# Altium schematic sheet 16encoder.SchDoc
size 381 x 558 mm; SheetNumber: 1; SheetTotal: 2
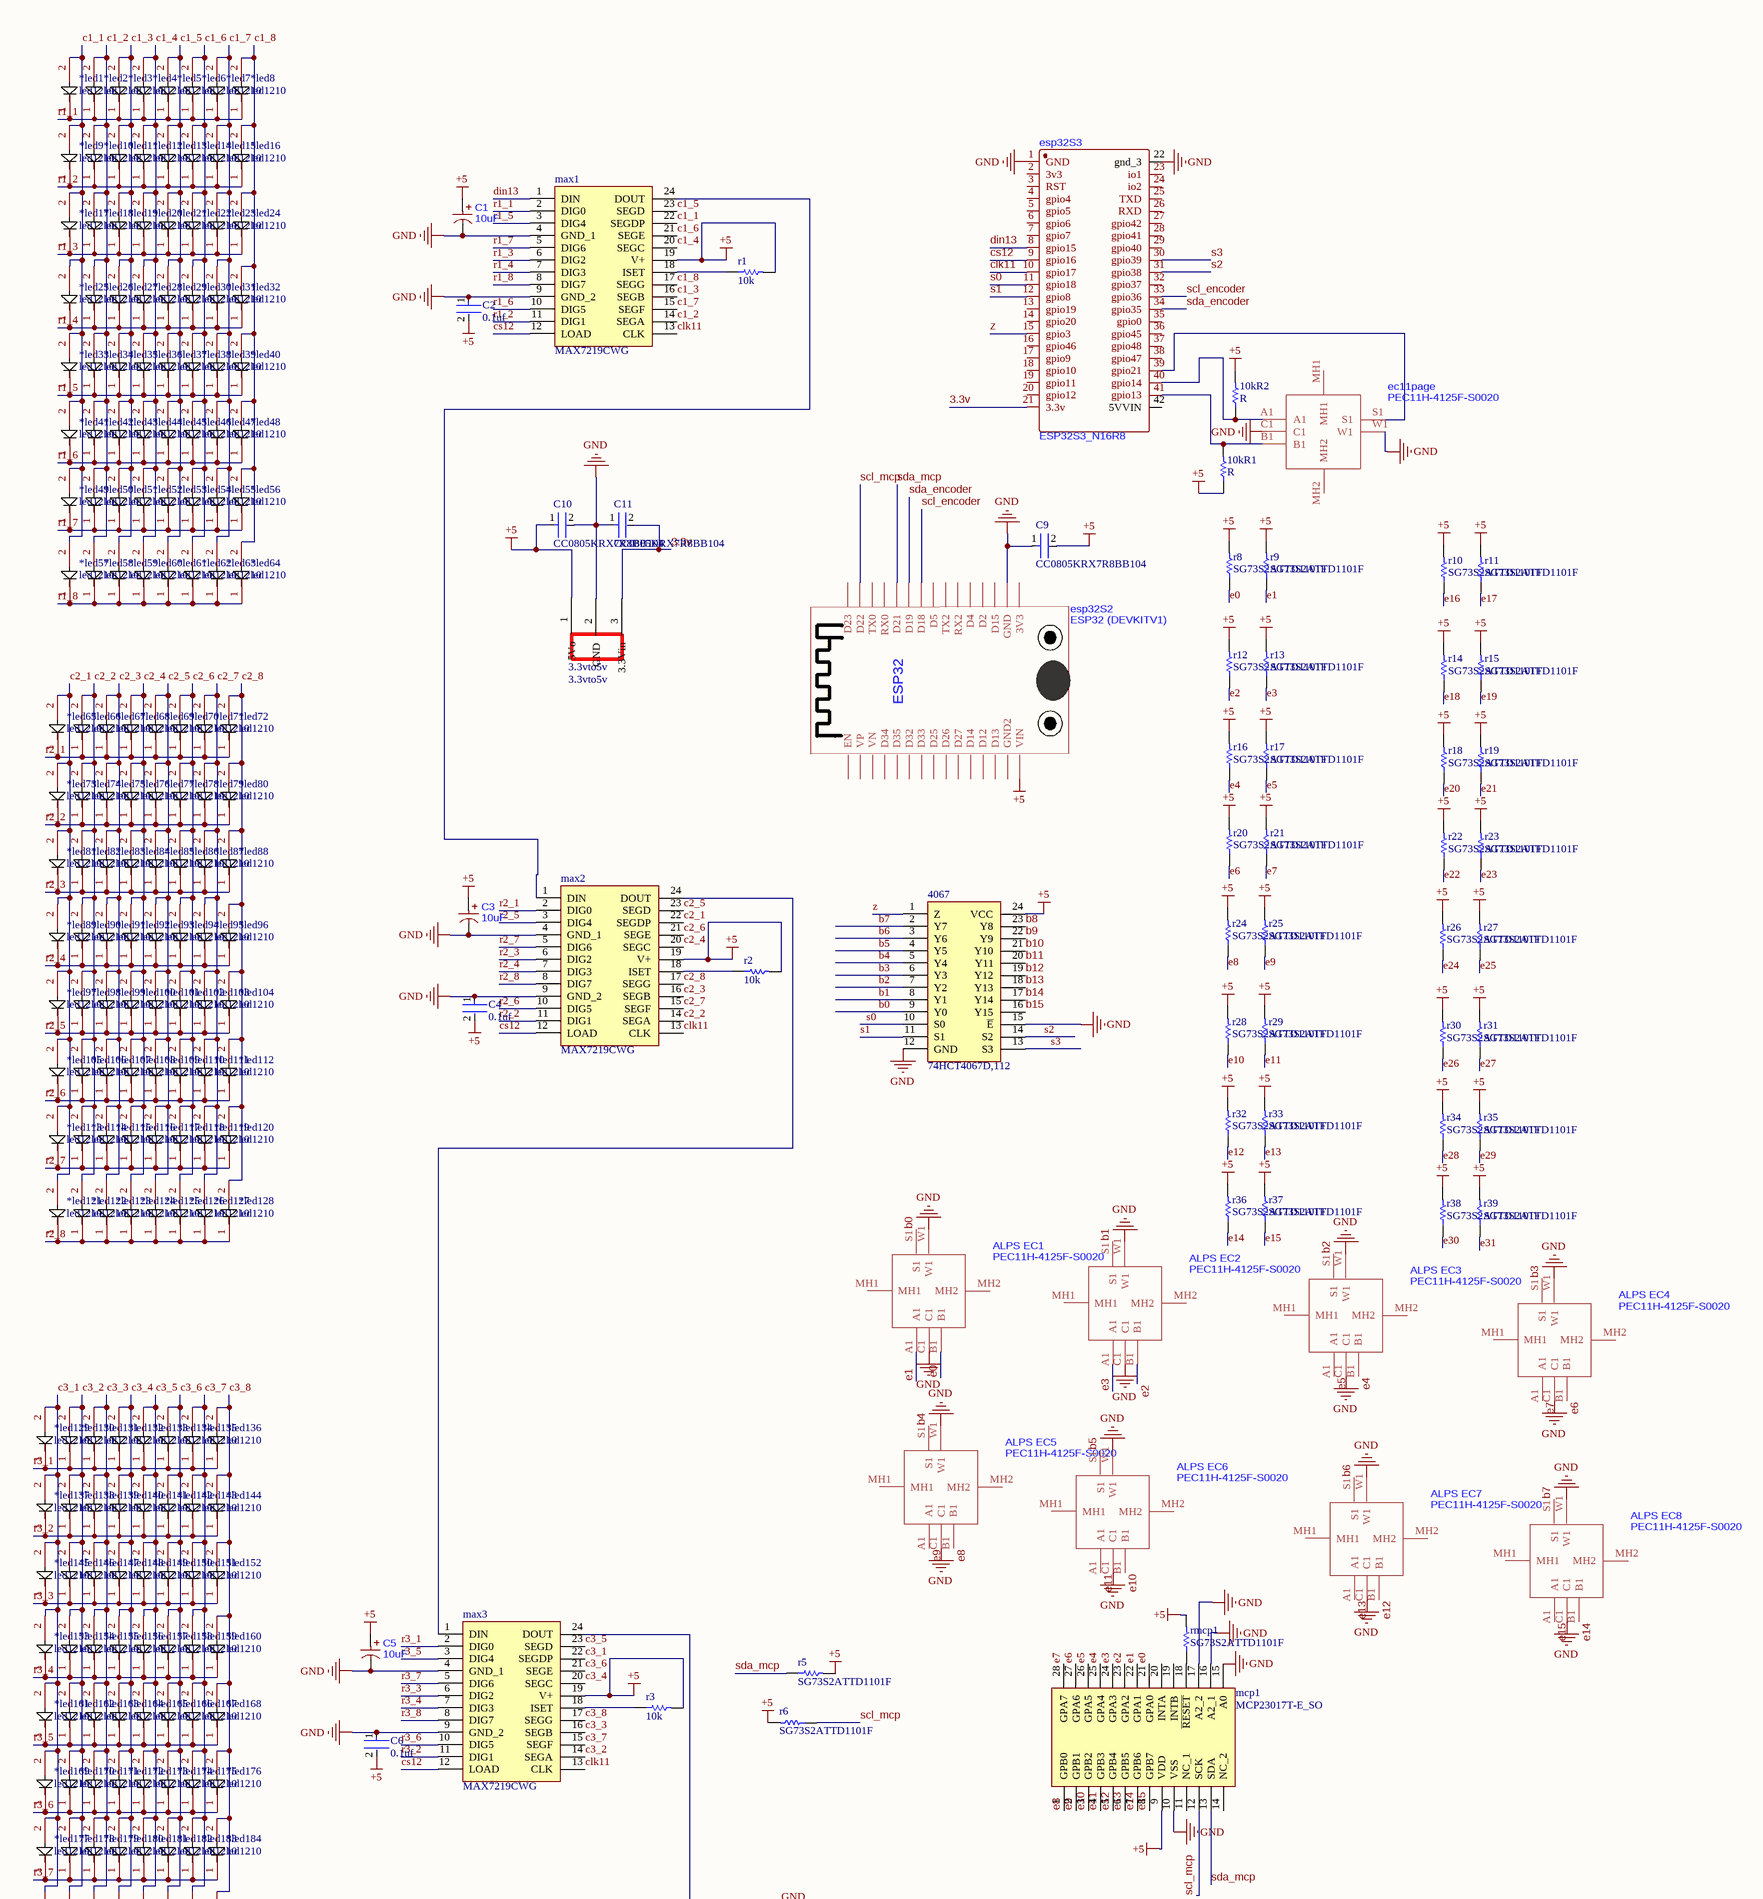
[diagram p0: 16encoder.SchDoc, top]
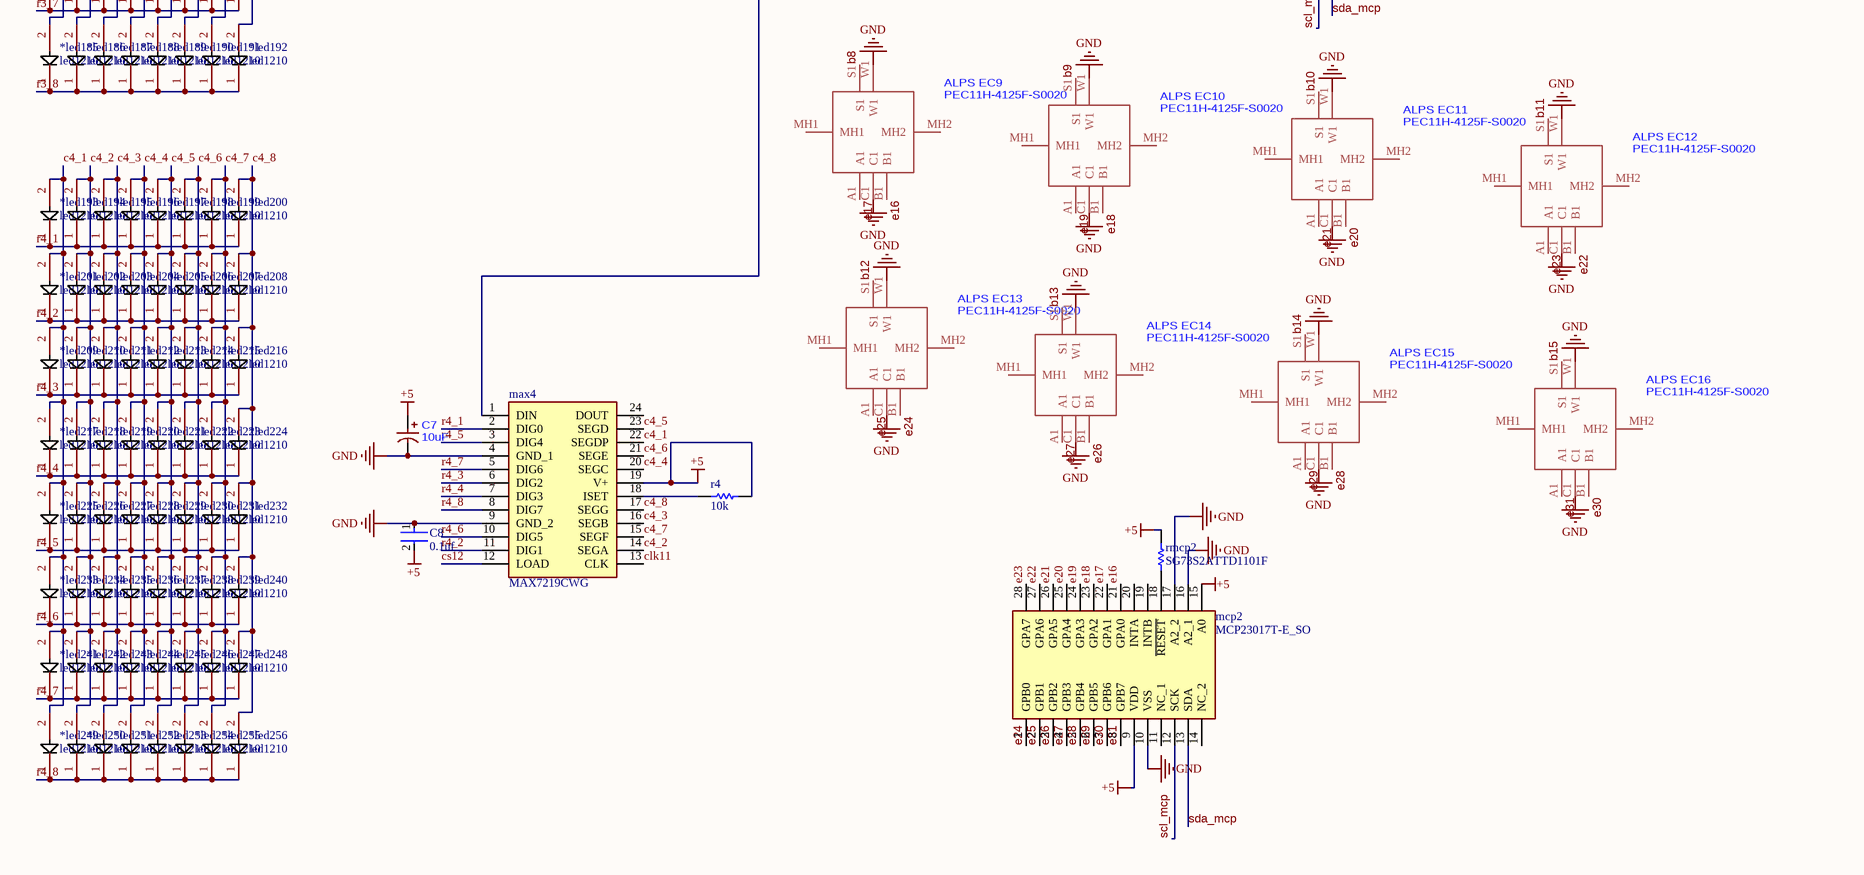
[diagram p1: 16encoder.SchDoc, bottom]

## Parts
3.3vto5v  3.3vto5v  [3.3vto5v]
10kR1  R  [RESC2013X60X30LL20T20]
10kR2  R  [RESC2013X60X30LL20T20]
4067  74HCT4067D,112  [SOIC127P1032X265-24N]
*led1  led1210  [1210贴片led]
*led2  led1210  [1210贴片led]
*led3  led1210  [1210贴片led]
*led4  led1210  [1210贴片led]
*led5  led1210  [1210贴片led]
*led6  led1210  [1210贴片led]
*led7  led1210  [1210贴片led]
*led8  led1210  [1210贴片led]
*led9  led1210  [1210贴片led]
*led10  led1210  [1210贴片led]
*led11  led1210  [1210贴片led]
*led12  led1210  [1210贴片led]
*led13  led1210  [1210贴片led]
*led14  led1210  [1210贴片led]
*led15  led1210  [1210贴片led]
*led16  led1210  [1210贴片led]
*led17  led1210  [1210贴片led]
*led18  led1210  [1210贴片led]
*led19  led1210  [1210贴片led]
*led20  led1210  [1210贴片led]
*led21  led1210  [1210贴片led]
*led22  led1210  [1210贴片led]
*led23  led1210  [1210贴片led]
*led24  led1210  [1210贴片led]
*led25  led1210  [1210贴片led]
*led26  led1210  [1210贴片led]
*led27  led1210  [1210贴片led]
*led28  led1210  [1210贴片led]
*led29  led1210  [1210贴片led]
*led30  led1210  [1210贴片led]
*led31  led1210  [1210贴片led]
*led32  led1210  [1210贴片led]
*led33  led1210  [1210贴片led]
*led34  led1210  [1210贴片led]
*led35  led1210  [1210贴片led]
*led36  led1210  [1210贴片led]
*led37  led1210  [1210贴片led]
*led38  led1210  [1210贴片led]
*led39  led1210  [1210贴片led]
*led40  led1210  [1210贴片led]
*led41  led1210  [1210贴片led]
*led42  led1210  [1210贴片led]
*led43  led1210  [1210贴片led]
*led44  led1210  [1210贴片led]
*led45  led1210  [1210贴片led]
*led46  led1210  [1210贴片led]
*led47  led1210  [1210贴片led]
*led48  led1210  [1210贴片led]
*led49  led1210  [1210贴片led]
*led50  led1210  [1210贴片led]
*led51  led1210  [1210贴片led]
*led52  led1210  [1210贴片led]
*led53  led1210  [1210贴片led]
*led54  led1210  [1210贴片led]
*led55  led1210  [1210贴片led]
*led56  led1210  [1210贴片led]
*led57  led1210  [1210贴片led]
*led58  led1210  [1210贴片led]
*led59  led1210  [1210贴片led]
*led60  led1210  [1210贴片led]
*led61  led1210  [1210贴片led]
*led62  led1210  [1210贴片led]
*led63  led1210  [1210贴片led]
*led64  led1210  [1210贴片led]
*led65  led1210  [1210贴片led]
*led66  led1210  [1210贴片led]
*led67  led1210  [1210贴片led]
*led68  led1210  [1210贴片led]
*led69  led1210  [1210贴片led]
*led70  led1210  [1210贴片led]
*led71  led1210  [1210贴片led]
*led72  led1210  [1210贴片led]
*led73  led1210  [1210贴片led]
*led74  led1210  [1210贴片led]
*led75  led1210  [1210贴片led]
*led76  led1210  [1210贴片led]
*led77  led1210  [1210贴片led]
*led78  led1210  [1210贴片led]
*led79  led1210  [1210贴片led]
*led80  led1210  [1210贴片led]
*led81  led1210  [1210贴片led]
*led82  led1210  [1210贴片led]
*led83  led1210  [1210贴片led]
*led84  led1210  [1210贴片led]
*led85  led1210  [1210贴片led]
*led86  led1210  [1210贴片led]
*led87  led1210  [1210贴片led]
*led88  led1210  [1210贴片led]
*led89  led1210  [1210贴片led]
*led90  led1210  [1210贴片led]
*led91  led1210  [1210贴片led]
*led92  led1210  [1210贴片led]
*led93  led1210  [1210贴片led]
*led94  led1210  [1210贴片led]
*led95  led1210  [1210贴片led]
*led96  led1210  [1210贴片led]
*led97  led1210  [1210贴片led]
*led98  led1210  [1210贴片led]
*led99  led1210  [1210贴片led]
*led100  led1210  [1210贴片led]
*led101  led1210  [1210贴片led]
*led102  led1210  [1210贴片led]
*led103  led1210  [1210贴片led]
*led104  led1210  [1210贴片led]
*led105  led1210  [1210贴片led]
*led106  led1210  [1210贴片led]
*led107  led1210  [1210贴片led]
*led108  led1210  [1210贴片led]
*led109  led1210  [1210贴片led]
*led110  led1210  [1210贴片led]
*led111  led1210  [1210贴片led]
*led112  led1210  [1210贴片led]
*led113  led1210  [1210贴片led]
*led114  led1210  [1210贴片led]
*led115  led1210  [1210贴片led]
*led116  led1210  [1210贴片led]
*led117  led1210  [1210贴片led]
*led118  led1210  [1210贴片led]
*led119  led1210  [1210贴片led]
*led120  led1210  [1210贴片led]
*led121  led1210  [1210贴片led]
*led122  led1210  [1210贴片led]
*led123  led1210  [1210贴片led]
*led124  led1210  [1210贴片led]
*led125  led1210  [1210贴片led]
*led126  led1210  [1210贴片led]
*led127  led1210  [1210贴片led]
*led128  led1210  [1210贴片led]
*led129  led1210  [1210贴片led]
*led130  led1210  [1210贴片led]
*led131  led1210  [1210贴片led]
*led132  led1210  [1210贴片led]
*led133  led1210  [1210贴片led]
*led134  led1210  [1210贴片led]
*led135  led1210  [1210贴片led]
*led136  led1210  [1210贴片led]
*led137  led1210  [1210贴片led]
*led138  led1210  [1210贴片led]
*led139  led1210  [1210贴片led]
*led140  led1210  [1210贴片led]
*led141  led1210  [1210贴片led]
*led142  led1210  [1210贴片led]
*led143  led1210  [1210贴片led]
*led144  led1210  [1210贴片led]
*led145  led1210  [1210贴片led]
*led146  led1210  [1210贴片led]
*led147  led1210  [1210贴片led]
*led148  led1210  [1210贴片led]
*led149  led1210  [1210贴片led]
*led150  led1210  [1210贴片led]
*led151  led1210  [1210贴片led]
*led152  led1210  [1210贴片led]
*led153  led1210  [1210贴片led]
*led154  led1210  [1210贴片led]
*led155  led1210  [1210贴片led]
*led156  led1210  [1210贴片led]
*led157  led1210  [1210贴片led]
*led158  led1210  [1210贴片led]
*led159  led1210  [1210贴片led]
*led160  led1210  [1210贴片led]
*led161  led1210  [1210贴片led]
*led162  led1210  [1210贴片led]
*led163  led1210  [1210贴片led]
*led164  led1210  [1210贴片led]
*led165  led1210  [1210贴片led]
*led166  led1210  [1210贴片led]
*led167  led1210  [1210贴片led]
*led168  led1210  [1210贴片led]
*led169  led1210  [1210贴片led]
*led170  led1210  [1210贴片led]
*led171  led1210  [1210贴片led]
*led172  led1210  [1210贴片led]
*led173  led1210  [1210贴片led]
*led174  led1210  [1210贴片led]
*led175  led1210  [1210贴片led]
*led176  led1210  [1210贴片led]
*led177  led1210  [1210贴片led]
*led178  led1210  [1210贴片led]
*led179  led1210  [1210贴片led]
*led180  led1210  [1210贴片led]
*led181  led1210  [1210贴片led]
*led182  led1210  [1210贴片led]
*led183  led1210  [1210贴片led]
*led184  led1210  [1210贴片led]
*led185  led1210  [1210贴片led]
*led186  led1210  [1210贴片led]
*led187  led1210  [1210贴片led]
*led188  led1210  [1210贴片led]
*led189  led1210  [1210贴片led]
*led190  led1210  [1210贴片led]
*led191  led1210  [1210贴片led]
*led192  led1210  [1210贴片led]
*led193  led1210  [1210贴片led]
*led194  led1210  [1210贴片led]
*led195  led1210  [1210贴片led]
*led196  led1210  [1210贴片led]
*led197  led1210  [1210贴片led]
*led198  led1210  [1210贴片led]
*led199  led1210  [1210贴片led]
*led200  led1210  [1210贴片led]
*led201  led1210  [1210贴片led]
*led202  led1210  [1210贴片led]
*led203  led1210  [1210贴片led]
*led204  led1210  [1210贴片led]
*led205  led1210  [1210贴片led]
*led206  led1210  [1210贴片led]
*led207  led1210  [1210贴片led]
*led208  led1210  [1210贴片led]
*led209  led1210  [1210贴片led]
*led210  led1210  [1210贴片led]
*led211  led1210  [1210贴片led]
*led212  led1210  [1210贴片led]
*led213  led1210  [1210贴片led]
*led214  led1210  [1210贴片led]
*led215  led1210  [1210贴片led]
*led216  led1210  [1210贴片led]
*led217  led1210  [1210贴片led]
*led218  led1210  [1210贴片led]
*led219  led1210  [1210贴片led]
*led220  led1210  [1210贴片led]
*led221  led1210  [1210贴片led]
*led222  led1210  [1210贴片led]
*led223  led1210  [1210贴片led]
*led224  led1210  [1210贴片led]
*led225  led1210  [1210贴片led]
*led226  led1210  [1210贴片led]
*led227  led1210  [1210贴片led]
*led228  led1210  [1210贴片led]
*led229  led1210  [1210贴片led]
*led230  led1210  [1210贴片led]
*led231  led1210  [1210贴片led]
*led232  led1210  [1210贴片led]
*led233  led1210  [1210贴片led]
*led234  led1210  [1210贴片led]
*led235  led1210  [1210贴片led]
*led236  led1210  [1210贴片led]
*led237  led1210  [1210贴片led]
*led238  led1210  [1210贴片led]
*led239  led1210  [1210贴片led]
*led240  led1210  [1210贴片led]
*led241  led1210  [1210贴片led]
*led242  led1210  [1210贴片led]
*led243  led1210  [1210贴片led]
*led244  led1210  [1210贴片led]
*led245  led1210  [1210贴片led]
*led246  led1210  [1210贴片led]
*led247  led1210  [1210贴片led]
*led248  led1210  [1210贴片led]
*led249  led1210  [1210贴片led]
*led250  led1210  [1210贴片led]
*led251  led1210  [1210贴片led]
*led252  led1210  [1210贴片led]
*led253  led1210  [1210贴片led]
*led254  led1210  [1210贴片led]
*led255  led1210  [1210贴片led]
*led256  led1210  [1210贴片led]
ALPS_EC1  PEC11H-4125F-S0020  [ALPS EC11]
ALPS_EC2  PEC11H-4125F-S0020  [ALPS EC11]
ALPS_EC3  PEC11H-4125F-S0020  [ALPS EC11]
ALPS_EC4  PEC11H-4125F-S0020  [ALPS EC11]
ALPS_EC5  PEC11H-4125F-S0020  [ALPS EC11]
ALPS_EC6  PEC11H-4125F-S0020  [ALPS EC11]
ALPS_EC7  PEC11H-4125F-S0020  [ALPS EC11]
ALPS_EC8  PEC11H-4125F-S0020  [ALPS EC11]
ALPS_EC9  PEC11H-4125F-S0020  [ALPS EC11]
ALPS_EC10  PEC11H-4125F-S0020  [ALPS EC11]
ALPS_EC11  PEC11H-4125F-S0020  [ALPS EC11]
ALPS_EC12  PEC11H-4125F-S0020  [ALPS EC11]
ALPS_EC13  PEC11H-4125F-S0020  [ALPS EC11]
ALPS_EC14  PEC11H-4125F-S0020  [ALPS EC11]
ALPS_EC15  PEC11H-4125F-S0020  [ALPS EC11]
ALPS_EC16  PEC11H-4125F-S0020  [ALPS EC11]
C1  10uF  [ELECTROLYTIC CAPACITOR SMD 4X5.4]
C2  0.1uf  [FP-CC0805-0_85-IPC_A]
C3  10uF  [ELECTROLYTIC CAPACITOR SMD 4X5.4]
C4  0.1uf  [FP-CC0805-0_85-IPC_A]
C5  10uF  [ELECTROLYTIC CAPACITOR SMD 4X5.4]
C6  0.1uf  [FP-CC0805-0_85-IPC_A]
C7  10uF  [ELECTROLYTIC CAPACITOR SMD 4X5.4]
C8  0.1uf  [FP-CC0805-0_85-IPC_A]
C9  CC0805KRX7R8BB104  [FP-CC0805-0_85-IPC_A]
C10  CC0805KRX7R8BB104  [FP-CC0805-0_85-IPC_A]
C11  CC0805KRX7R8BB104  [FP-CC0805-0_85-IPC_A]
ec11page  PEC11H-4125F-S0020  [ALPS EC11]
esp32S2  ESP32 (DEVKITV1)  [ESP32-DEVKITV1_ESP32-DEVKITV1]
esp32S3  ESP32S3_N16R8  [ESP32 S3 N16R8]
max1  MAX7219CWG  [SOIC127P1032X265-24N]
max2  MAX7219CWG  [SOIC127P1032X265-24N]
max3  MAX7219CWG  [SOIC127P1032X265-24N]
max4  MAX7219CWG  [SOIC127P1032X265-24N]
mcp1  MCP23017T-E_SO  [SOIC127P1030X265-28N]
mcp2  MCP23017T-E_SO  [SOIC127P1030X265-28N]
r1  10k  [RESC2013X60X30LL20T20]
r2  10k  [RESC2013X60X30LL20T20]
r3  10k  [RESC2013X60X30LL20T20]
r4  10k  [RESC2013X60X30LL20T20]
r5  SG73S2ATTD1101F  [RESC2013X60X30LL20T20]
r6  SG73S2ATTD1101F  [RESC2013X60X30LL20T20]
r8  SG73S2ATTD1101F  [RESC2013X60X30LL20T20]
r9  SG73S2ATTD1101F  [RESC2013X60X30LL20T20]
r10  SG73S2ATTD1101F  [RESC2013X60X30LL20T20]
r11  SG73S2ATTD1101F  [RESC2013X60X30LL20T20]
r12  SG73S2ATTD1101F  [RESC2013X60X30LL20T20]
r13  SG73S2ATTD1101F  [RESC2013X60X30LL20T20]
r14  SG73S2ATTD1101F  [RESC2013X60X30LL20T20]
r15  SG73S2ATTD1101F  [RESC2013X60X30LL20T20]
r16  SG73S2ATTD1101F  [RESC2013X60X30LL20T20]
r17  SG73S2ATTD1101F  [RESC2013X60X30LL20T20]
r18  SG73S2ATTD1101F  [RESC2013X60X30LL20T20]
r19  SG73S2ATTD1101F  [RESC2013X60X30LL20T20]
r20  SG73S2ATTD1101F  [RESC2013X60X30LL20T20]
r21  SG73S2ATTD1101F  [RESC2013X60X30LL20T20]
r22  SG73S2ATTD1101F  [RESC2013X60X30LL20T20]
r23  SG73S2ATTD1101F  [RESC2013X60X30LL20T20]
r24  SG73S2ATTD1101F  [RESC2013X60X30LL20T20]
r25  SG73S2ATTD1101F  [RESC2013X60X30LL20T20]
r26  SG73S2ATTD1101F  [RESC2013X60X30LL20T20]
r27  SG73S2ATTD1101F  [RESC2013X60X30LL20T20]
r28  SG73S2ATTD1101F  [RESC2013X60X30LL20T20]
r29  SG73S2ATTD1101F  [RESC2013X60X30LL20T20]
r30  SG73S2ATTD1101F  [RESC2013X60X30LL20T20]
r31  SG73S2ATTD1101F  [RESC2013X60X30LL20T20]
r32  SG73S2ATTD1101F  [RESC2013X60X30LL20T20]
r33  SG73S2ATTD1101F  [RESC2013X60X30LL20T20]
r34  SG73S2ATTD1101F  [RESC2013X60X30LL20T20]
r35  SG73S2ATTD1101F  [RESC2013X60X30LL20T20]
r36  SG73S2ATTD1101F  [RESC2013X60X30LL20T20]
r37  SG73S2ATTD1101F  [RESC2013X60X30LL20T20]
r38  SG73S2ATTD1101F  [RESC2013X60X30LL20T20]
r39  SG73S2ATTD1101F  [RESC2013X60X30LL20T20]
rmcp1  SG73S2ATTD1101F  [RESC2013X60X30LL20T20]
rmcp2  SG73S2ATTD1101F  [RESC2013X60X30LL20T20]

## Nets
+5: 3.3vto5v.1(5Vo) 10kR1.1 10kR2.2 4067.24(VCC) C1.1 C2.2 C3.1 C4.2 C5.1 C6.2 C7.1 C8.2 C9.2 C10.1 esp32S2.VIN max1.19(V+) max2.19(V+) max3.19(V+) max4.19(V+) mcp1.9(VDD) mcp2.9(VDD) mcp2.15(A0) r1.2 r2.2 r3.2 r4.2 r5.2 r6.2 r8.2 r9.2 r10.2 r11.2 r12.2 r13.2 r14.2 r15.2 r16.2 r17.2 r18.2 r19.2 r20.2 r21.2 r22.2 r23.2 r24.2 r25.2 r26.2 r27.2 r28.2 r29.2 r30.2 r31.2 r32.2 r33.2 r34.2 r35.2 r36.2 r37.2 r38.2 r39.2 rmcp1.2 rmcp2.2
GND: 3.3vto5v.2(GND) 4067.12(GND) 4067.15(~{E}) ALPS_EC1.C1 ALPS_EC1.W1 ALPS_EC2.C1 ALPS_EC2.W1 ALPS_EC3.C1 ALPS_EC3.W1 ALPS_EC4.C1 ALPS_EC4.W1 ALPS_EC5.C1 ALPS_EC5.W1 ALPS_EC6.C1 ALPS_EC6.W1 ALPS_EC7.C1 ALPS_EC7.W1 ALPS_EC8.C1 ALPS_EC8.W1 ALPS_EC9.C1 ALPS_EC9.W1 ALPS_EC10.C1 ALPS_EC10.W1 ALPS_EC11.C1 ALPS_EC11.W1 ALPS_EC12.C1 ALPS_EC12.W1 ALPS_EC13.C1 ALPS_EC13.W1 ALPS_EC14.C1 ALPS_EC14.W1 ALPS_EC15.C1 ALPS_EC15.W1 ALPS_EC16.C1 ALPS_EC16.W1 C1.2 C2.1 C3.2 C4.1 C5.2 C6.1 C7.2 C8.1 C9.1 C10.2 C11.1 ec11page.C1 ec11page.W1 esp32S2.GND esp32S3.1(GND) esp32S3.22(gnd_3) max1.4(GND_1) max1.9(GND_2) max2.4(GND_1) max2.9(GND_2) max3.4(GND_1) max3.9(GND_2) max4.4(GND_1) max4.9(GND_2) mcp1.10(VSS) mcp1.15(A0) mcp1.16(A2_1) mcp1.17(A2_2) mcp2.10(VSS) mcp2.16(A2_1) mcp2.17(A2_2)
3.3v: 3.3vto5v.3(3.3Vin) C11.2 esp32S3.21(3.3v)
b0: 4067.9(Y0) ALPS_EC1.S1
b1: 4067.8(Y1) ALPS_EC2.S1
b2: 4067.7(Y2) ALPS_EC3.S1
b3: 4067.6(Y3) ALPS_EC4.S1
b4: 4067.5(Y4) ALPS_EC5.S1
b5: 4067.4(Y5) ALPS_EC6.S1
b6: 4067.3(Y6) ALPS_EC7.S1
b7: 4067.2(Y7) ALPS_EC8.S1
b8: 4067.23(Y8) ALPS_EC9.S1
b9: 4067.22(Y9) ALPS_EC10.S1
b10: 4067.21(Y10) ALPS_EC11.S1
b11: 4067.20(Y11) ALPS_EC12.S1
b12: 4067.19(Y12) ALPS_EC13.S1
b13: 4067.18(Y13) ALPS_EC14.S1
b14: 4067.17(Y14) ALPS_EC15.S1
b15: 4067.16(Y15) ALPS_EC16.S1
c1_1: *led1.2 *led9.2 *led17.2 *led25.2 *led33.2 *led41.2 *led49.2 *led57.2 max1.22(SEGDP)
c1_2: *led2.2 *led10.2 *led18.2 *led26.2 *led34.2 *led42.2 *led50.2 *led58.2 max1.14(SEGA)
c1_3: *led3.2 *led11.2 *led19.2 *led27.2 *led35.2 *led43.2 *led51.2 *led59.2 max1.16(SEGB)
c1_4: *led4.2 *led12.2 *led20.2 *led28.2 *led36.2 *led44.2 *led52.2 *led60.2 max1.20(SEGC)
c1_5: *led5.2 *led13.2 *led21.2 *led29.2 *led37.2 *led45.2 *led53.2 *led61.2 max1.23(SEGD)
c1_6: *led6.2 *led14.2 *led22.2 *led30.2 *led38.2 *led46.2 *led54.2 *led62.2 max1.21(SEGE)
c1_7: *led7.2 *led15.2 *led23.2 *led31.2 *led39.2 *led47.2 *led55.2 *led63.2 max1.15(SEGF)
c1_8: *led8.2 *led16.2 *led24.2 *led32.2 *led40.2 *led48.2 *led56.2 *led64.2 max1.17(SEGG)
c2_1: *led65.2 *led73.2 *led81.2 *led89.2 *led97.2 *led105.2 *led113.2 *led121.2 max2.22(SEGDP)
c2_2: *led66.2 *led74.2 *led82.2 *led90.2 *led98.2 *led106.2 *led114.2 *led122.2 max2.14(SEGA)
c2_3: *led67.2 *led75.2 *led83.2 *led91.2 *led99.2 *led107.2 *led115.2 *led123.2 max2.16(SEGB)
c2_4: *led68.2 *led76.2 *led84.2 *led92.2 *led100.2 *led108.2 *led116.2 *led124.2 max2.20(SEGC)
c2_5: *led69.2 *led77.2 *led85.2 *led93.2 *led101.2 *led109.2 *led117.2 *led125.2 max2.23(SEGD)
c2_6: *led70.2 *led78.2 *led86.2 *led94.2 *led102.2 *led110.2 *led118.2 *led126.2 max2.21(SEGE)
c2_7: *led71.2 *led79.2 *led87.2 *led95.2 *led103.2 *led111.2 *led119.2 *led127.2 max2.15(SEGF)
c2_8: *led72.2 *led80.2 *led88.2 *led96.2 *led104.2 *led112.2 *led120.2 *led128.2 max2.17(SEGG)
c3_1: *led129.2 *led137.2 *led145.2 *led153.2 *led161.2 *led169.2 *led177.2 *led185.2 max3.22(SEGDP)
c3_2: *led130.2 *led138.2 *led146.2 *led154.2 *led162.2 *led170.2 *led178.2 *led186.2 max3.14(SEGA)
c3_3: *led131.2 *led139.2 *led147.2 *led155.2 *led163.2 *led171.2 *led179.2 *led187.2 max3.16(SEGB)
c3_4: *led132.2 *led140.2 *led148.2 *led156.2 *led164.2 *led172.2 *led180.2 *led188.2 max3.20(SEGC)
c3_5: *led133.2 *led141.2 *led149.2 *led157.2 *led165.2 *led173.2 *led181.2 *led189.2 max3.23(SEGD)
c3_6: *led134.2 *led142.2 *led150.2 *led158.2 *led166.2 *led174.2 *led182.2 *led190.2 max3.21(SEGE)
c3_7: *led135.2 *led143.2 *led151.2 *led159.2 *led167.2 *led175.2 *led183.2 *led191.2 max3.15(SEGF)
c3_8: *led136.2 *led144.2 *led152.2 *led160.2 *led168.2 *led176.2 *led184.2 *led192.2 max3.17(SEGG)
c4_1: *led193.2 *led201.2 *led209.2 *led217.2 *led225.2 *led233.2 *led241.2 *led249.2 max4.22(SEGDP)
c4_2: *led194.2 *led202.2 *led210.2 *led218.2 *led226.2 *led234.2 *led242.2 *led250.2 max4.14(SEGA)
c4_3: *led195.2 *led203.2 *led211.2 *led219.2 *led227.2 *led235.2 *led243.2 *led251.2 max4.16(SEGB)
c4_4: *led196.2 *led204.2 *led212.2 *led220.2 *led228.2 *led236.2 *led244.2 *led252.2 max4.20(SEGC)
c4_5: *led197.2 *led205.2 *led213.2 *led221.2 *led229.2 *led237.2 *led245.2 *led253.2 max4.23(SEGD)
c4_6: *led198.2 *led206.2 *led214.2 *led222.2 *led230.2 *led238.2 *led246.2 *led254.2 max4.21(SEGE)
c4_7: *led199.2 *led207.2 *led215.2 *led223.2 *led231.2 *led239.2 *led247.2 *led255.2 max4.15(SEGF)
c4_8: *led200.2 *led208.2 *led216.2 *led224.2 *led232.2 *led240.2 *led248.2 *led256.2 max4.17(SEGG)
clk11: esp32S3.10(gpio17) max1.13(CLK) max2.13(CLK) max3.13(CLK) max4.13(CLK)
cs12: esp32S3.9(gpio16) max1.12(LOAD) max2.12(LOAD) max3.12(LOAD) max4.12(LOAD)
din13: esp32S3.8(gpio15) max1.1(DIN)
e0: ALPS_EC1.B1 mcp1.21(GPA0) r8.1
e1: ALPS_EC1.A1 mcp1.22(GPA1) r9.1
e2: ALPS_EC2.B1 mcp1.23(GPA2) r12.1
e3: ALPS_EC2.A1 mcp1.24(GPA3) r13.1
e4: ALPS_EC3.B1 mcp1.25(GPA4) r16.1
e5: ALPS_EC3.A1 mcp1.26(GPA5) r17.1
e6: ALPS_EC4.B1 mcp1.27(GPA6) r20.1
e7: ALPS_EC4.A1 mcp1.28(GPA7) r21.1
e8: ALPS_EC5.B1 mcp1.1(GPB0) r24.1
e9: ALPS_EC5.A1 mcp1.2(GPB1) r25.1
e10: ALPS_EC6.B1 mcp1.3(GPB2) r28.1
e11: ALPS_EC6.A1 mcp1.4(GPB3) r29.1
e12: ALPS_EC7.B1 mcp1.5(GPB4) r32.1
e13: ALPS_EC7.A1 mcp1.6(GPB5) r33.1
e14: ALPS_EC8.B1 mcp1.7(GPB6) r36.1
e15: ALPS_EC8.A1 mcp1.8(GPB7) r37.1
e16: ALPS_EC9.B1 mcp2.21(GPA0) r10.1
e17: ALPS_EC9.A1 mcp2.22(GPA1) r11.1
e18: ALPS_EC10.B1 mcp2.23(GPA2) r14.1
e19: ALPS_EC10.A1 mcp2.24(GPA3) r15.1
e20: ALPS_EC11.B1 mcp2.25(GPA4) r18.1
e21: ALPS_EC11.A1 mcp2.26(GPA5) r19.1
e22: ALPS_EC12.B1 mcp2.27(GPA6) r22.1
e23: ALPS_EC12.A1 mcp2.28(GPA7) r23.1
e24: ALPS_EC13.B1 mcp2.1(GPB0) r26.1
e25: ALPS_EC13.A1 mcp2.2(GPB1) r27.1
e26: ALPS_EC14.B1 mcp2.3(GPB2) r30.1
e27: ALPS_EC14.A1 mcp2.4(GPB3) r31.1
e28: ALPS_EC15.B1 mcp2.5(GPB4) r34.1
e29: ALPS_EC15.A1 mcp2.6(GPB5) r35.1
e30: ALPS_EC16.B1 mcp2.7(GPB6) r38.1
e31: ALPS_EC16.A1 mcp2.8(GPB7) r39.1
r1_1: *led1.1 *led2.1 *led3.1 *led4.1 *led5.1 *led6.1 *led7.1 *led8.1 max1.2(DIG0)
r1_2: *led9.1 *led10.1 *led11.1 *led12.1 *led13.1 *led14.1 *led15.1 *led16.1 max1.11(DIG1)
r1_3: *led17.1 *led18.1 *led19.1 *led20.1 *led21.1 *led22.1 *led23.1 *led24.1 max1.6(DIG2)
r1_4: *led25.1 *led26.1 *led27.1 *led28.1 *led29.1 *led30.1 *led31.1 *led32.1 max1.7(DIG3)
r1_5: *led33.1 *led34.1 *led35.1 *led36.1 *led37.1 *led38.1 *led39.1 *led40.1 max1.3(DIG4)
r1_6: *led41.1 *led42.1 *led43.1 *led44.1 *led45.1 *led46.1 *led47.1 *led48.1 max1.10(DIG5)
r1_7: *led49.1 *led50.1 *led51.1 *led52.1 *led53.1 *led54.1 *led55.1 *led56.1 max1.5(DIG6)
r1_8: *led57.1 *led58.1 *led59.1 *led60.1 *led61.1 *led62.1 *led63.1 *led64.1 max1.8(DIG7)
r2_1: *led65.1 *led66.1 *led67.1 *led68.1 *led69.1 *led70.1 *led71.1 *led72.1 max2.2(DIG0)
r2_2: *led73.1 *led74.1 *led75.1 *led76.1 *led77.1 *led78.1 *led79.1 *led80.1 max2.11(DIG1)
r2_3: *led81.1 *led82.1 *led83.1 *led84.1 *led85.1 *led86.1 *led87.1 *led88.1 max2.6(DIG2)
r2_4: *led89.1 *led90.1 *led91.1 *led92.1 *led93.1 *led94.1 *led95.1 *led96.1 max2.7(DIG3)
r2_5: *led97.1 *led98.1 *led99.1 *led100.1 *led101.1 *led102.1 *led103.1 *led104.1 max2.3(DIG4)
r2_6: *led105.1 *led106.1 *led107.1 *led108.1 *led109.1 *led110.1 *led111.1 *led112.1 max2.10(DIG5)
r2_7: *led113.1 *led114.1 *led115.1 *led116.1 *led117.1 *led118.1 *led119.1 *led120.1 max2.5(DIG6)
r2_8: *led121.1 *led122.1 *led123.1 *led124.1 *led125.1 *led126.1 *led127.1 *led128.1 max2.8(DIG7)
r3_1: *led129.1 *led130.1 *led131.1 *led132.1 *led133.1 *led134.1 *led135.1 *led136.1 max3.2(DIG0)
r3_2: *led137.1 *led138.1 *led139.1 *led140.1 *led141.1 *led142.1 *led143.1 *led144.1 max3.11(DIG1)
r3_3: *led145.1 *led146.1 *led147.1 *led148.1 *led149.1 *led150.1 *led151.1 *led152.1 max3.6(DIG2)
r3_4: *led153.1 *led154.1 *led155.1 *led156.1 *led157.1 *led158.1 *led159.1 *led160.1 max3.7(DIG3)
r3_5: *led161.1 *led162.1 *led163.1 *led164.1 *led165.1 *led166.1 *led167.1 *led168.1 max3.3(DIG4)
r3_6: *led169.1 *led170.1 *led171.1 *led172.1 *led173.1 *led174.1 *led175.1 *led176.1 max3.10(DIG5)
r3_7: *led177.1 *led178.1 *led179.1 *led180.1 *led181.1 *led182.1 *led183.1 *led184.1 max3.5(DIG6)
r3_8: *led185.1 *led186.1 *led187.1 *led188.1 *led189.1 *led190.1 *led191.1 *led192.1 max3.8(DIG7)
r4_1: *led193.1 *led194.1 *led195.1 *led196.1 *led197.1 *led198.1 *led199.1 *led200.1 max4.2(DIG0)
r4_2: *led201.1 *led202.1 *led203.1 *led204.1 *led205.1 *led206.1 *led207.1 *led208.1 max4.11(DIG1)
r4_3: *led209.1 *led210.1 *led211.1 *led212.1 *led213.1 *led214.1 *led215.1 *led216.1 max4.6(DIG2)
r4_4: *led217.1 *led218.1 *led219.1 *led220.1 *led221.1 *led222.1 *led223.1 *led224.1 max4.7(DIG3)
r4_5: *led225.1 *led226.1 *led227.1 *led228.1 *led229.1 *led230.1 *led231.1 *led232.1 max4.3(DIG4)
r4_6: *led233.1 *led234.1 *led235.1 *led236.1 *led237.1 *led238.1 *led239.1 *led240.1 max4.10(DIG5)
r4_7: *led241.1 *led242.1 *led243.1 *led244.1 *led245.1 *led246.1 *led247.1 *led248.1 max4.5(DIG6)
r4_8: *led249.1 *led250.1 *led251.1 *led252.1 *led253.1 *led254.1 *led255.1 *led256.1 max4.8(DIG7)
s0: 4067.10(S0) esp32S3.11(gpio18)
s1: 4067.11(S1) esp32S3.12(gpio8)
s2: 4067.14(S2) esp32S3.31(gpio38)
s3: 4067.13(S3) esp32S3.30(gpio39)
scl_encoder: esp32S2.D18 esp32S3.33(gpio36)
scl_mcp: esp32S2.D22 mcp1.12(SCK) mcp2.12(SCK) r6.1
sda_encoder: esp32S2.D19 esp32S3.34(gpio35)
sda_mcp: esp32S2.D21 mcp1.13(SDA) mcp2.13(SDA) r5.1
z: 4067.1(Z) esp32S3.15(gpio3)
Net10kR1_2: 10kR1.2 ec11page.B1 esp32S3.41(gpio13)
Net10kR2_1: 10kR2.1 ec11page.A1 esp32S3.40(gpio14)
Netec11page_S1: ec11page.S1 esp32S3.39(gpio21)
Netmax1_18: max1.18(ISET) r1.1
Netmax1_24: max1.24(DOUT) max2.1(DIN)
Netmax2_18: max2.18(ISET) r2.1
Netmax2_24: max2.24(DOUT) max3.1(DIN)
Netmax3_18: max3.18(ISET) r3.1
Netmax3_24: max3.24(DOUT) max4.1(DIN)
Netmax4_18: max4.18(ISET) r4.1
Netmcp1_18: mcp1.18(~{RESET}) rmcp1.1
Netmcp2_18: mcp2.18(~{RESET}) rmcp2.1

Not connected (* = marked no-connect by the designer): ALPS_EC1 MH1 MH2; ALPS_EC2 MH1 MH2; ALPS_EC3 MH1 MH2; ALPS_EC4 MH1 MH2; ALPS_EC5 MH1 MH2; ALPS_EC6 MH1 MH2; ALPS_EC7 MH1 MH2; ALPS_EC8 MH1 MH2; ALPS_EC9 MH1 MH2; ALPS_EC10 MH1 MH2; ALPS_EC11 MH1 MH2; ALPS_EC12 MH1 MH2; ALPS_EC13 MH1 MH2; ALPS_EC14 MH1 MH2; ALPS_EC15 MH1 MH2; ALPS_EC16 MH1 MH2; ec11page MH1 MH2; esp32S2 3V3 D2 D4 D5 D12 D13 D14 D15 D23 D25 D26 D27 D32 D33 D34 D35 EN GND2 RX0 RX2 TX0 TX2 VN VP; esp32S3 2(3v3) 3(RST) 4(gpio4) 5(gpio5) 6(gpio6) 7(gpio7) 13(gpio19) 14(gpio20) 16(gpio46) 17(gpio9) 18(gpio10) 19(gpio11) 20(gpio12) 23(io1) 24(io2) 25(TXD) 26(RXD) 27(gpio42) 28(gpio41) 29(gpio40) 32(gpio37) 35(gpio0) 36(gpio45) 37(gpio48) 38(gpio47) 42(5VVIN); max4 24(DOUT); mcp1 11(NC_1) 14(NC_2) 19(INTB) 20(INTA); mcp2 11(NC_1) 14(NC_2) 19(INTB) 20(INTA)

## Notes on the sheet
- (in symbol ESP32 (DEVKITV1)) ESP32

## Library data of the parts
10kR1 10kR2 r1-r4 = CMP-2001-02660-1: Manufacturer: KOA Speer; Part Number: SG73S2ATTD1101F
4067 = 74HCT4067D,112: Integrated Circuit; Manufacturer_Name: Nexperia; Datasheet Link: https://assets.nexperia.com/documents/data-sheet/74HC_HCT4067.pdf; Height: 2.65mm; Manufacturer_Part_Number: 74HCT4067D,112; Mouser Part Number: 771-74HCT4067D; Mouser Price/Stock: https://www.mouser.co.uk/ProductDetail/Nexperia/74HCT4067D112?qs=me8TqzrmIYUmedr29OWL5Q%3D%3D; Arrow Part Number: 74HCT4067D,112; Arrow Price/Stock: https://www.arrow.com/en/products/74hct4067d112/nexperia
C1 C3 C5 C7 = 4.3 X 4.3 ELECTROLYTIC  CAPACITOR SMD μF
C2 C4 C6 C8 = CMP-1036-04410-2: CAP CER 0.1UF 25V X7R 0805; Manufacturer Part Number: CC0805KRX7R8BB104; Manufacturer: Yageo; Tolerance: 0.1; Material: Ceramic; Value: 100 nF; ComponentLink2URL: http://www.yageo.com/documents/recent/UPY-GPHC_Y5V_6.3V-to-50V_8.pdf; Category: Cap; Mouser Description: Multilayer Ceramic Capacitors MLCC - SMD/SMT 100nF 25V X7R 10%; Device Class L1: Passive Components; Footprint Url: http://www.yageo.com/exep/pages/download/literatures/UPY-C_GEN_24.pdf; Height: 0.95mm; Digikey Description: CAP CER 0.1UF 25V X7R 0805; Lead Free: Yes; Temperature Range High: +85°C; Temperature: -30°C to +85°C; Ipc Land Pattern Name: CAPC200125X85; Capacitance: 100 nF; Automotive: No; Octopart: https://octopart.com/cc0805krx7r8bb104-yageo-39467766; Device Class L2: Capacitors; Temperature Characteristic: X7R; Voltage Rating: 25 V; ComponentLink2Description: Datasheet; Temperature Range Low: -30°C; Device Class L3: Ceramic Capacitors; RoHS: TRUE; Package: CC0805-0.85
C9-C11 = CMP-1036-04410-2: CAP CER 0.1UF 25V X7R 0805; Manufacturer: Yageo; Tolerance: 0.1; Material: Ceramic; Value: 100 nF; ComponentLink2URL: http://www.yageo.com/documents/recent/UPY-GPHC_Y5V_6.3V-to-50V_8.pdf; Category: Cap; Mouser Description: Multilayer Ceramic Capacitors MLCC - SMD/SMT 100nF 25V X7R 10%; Manufacturer Part Number: CC0805KRX7R8BB104; Device Class L1: Passive Components; Footprint Url: http://www.yageo.com/exep/pages/download/literatures/UPY-C_GEN_24.pdf; Height: 0.95mm; Digikey Description: CAP CER 0.1UF 25V X7R 0805; Lead Free: Yes; Temperature Range High: +85°C; Temperature: -30°C to +85°C; Ipc Land Pattern Name: CAPC200125X85; Capacitance: 100 nF; Automotive: No; Octopart: https://octopart.com/cc0805krx7r8bb104-yageo-39467766; Device Class L2: Capacitors; Temperature Characteristic: X7R; Voltage Rating: 25 V; ComponentLink2Description: Datasheet; Temperature Range Low: -30°C; Device Class L3: Ceramic Capacitors; RoHS: TRUE; Package: CC0805-0.85
max1-max4 = MAX7219CWG: Integrated Circuit; Manufacturer_Name: Analog Devices; Datasheet Link: http://datasheets.maximintegrated.com/en/ds/MAX7219-MAX7221.pdf; Height: 2.65mm; Manufacturer_Part_Number: MAX7219CWG; Mouser Part Number: 700-MAX7219CWG-NR; Mouser Price/Stock: https://www.mouser.co.uk/ProductDetail/Analog-Devices-Maxim-Integrated/MAX7219CWG?qs=p6VZ%252BklCkRRXY8S0D%252BcNmA%3D%3D
mcp1 mcp2 = MCP23017T-E_SO: Integrated Circuit; Manufacturer_Name: Microchip; Manufacturer_Part_Number: MCP23017T-E/SO; Datasheet Link: http://ww1.microchip.com/downloads/en/DeviceDoc/20001952C.pdf; Height: 2.65mm; Mouser Part Number: 579-MCP23017T-E/SO; Mouser Price/Stock: https://www.mouser.co.uk/ProductDetail/Microchip-Technology/MCP23017T-E-SO?qs=usxtMOJb1RylPfT%252BJtgE3Q%3D%3D; Arrow Part Number: MCP23017T-E/SO; Arrow Price/Stock: https://www.arrow.com/en/products/mcp23017t-eso/microchip-technology?region=nac
r5 r6 r8-r39 rmcp1 rmcp2 = CMP-2001-02660-1: Manufacturer: KOA Speer; Part Number: SG73S2ATTD1101F